# EasyEDA Pro project PCB2.epro

# Board PCB2
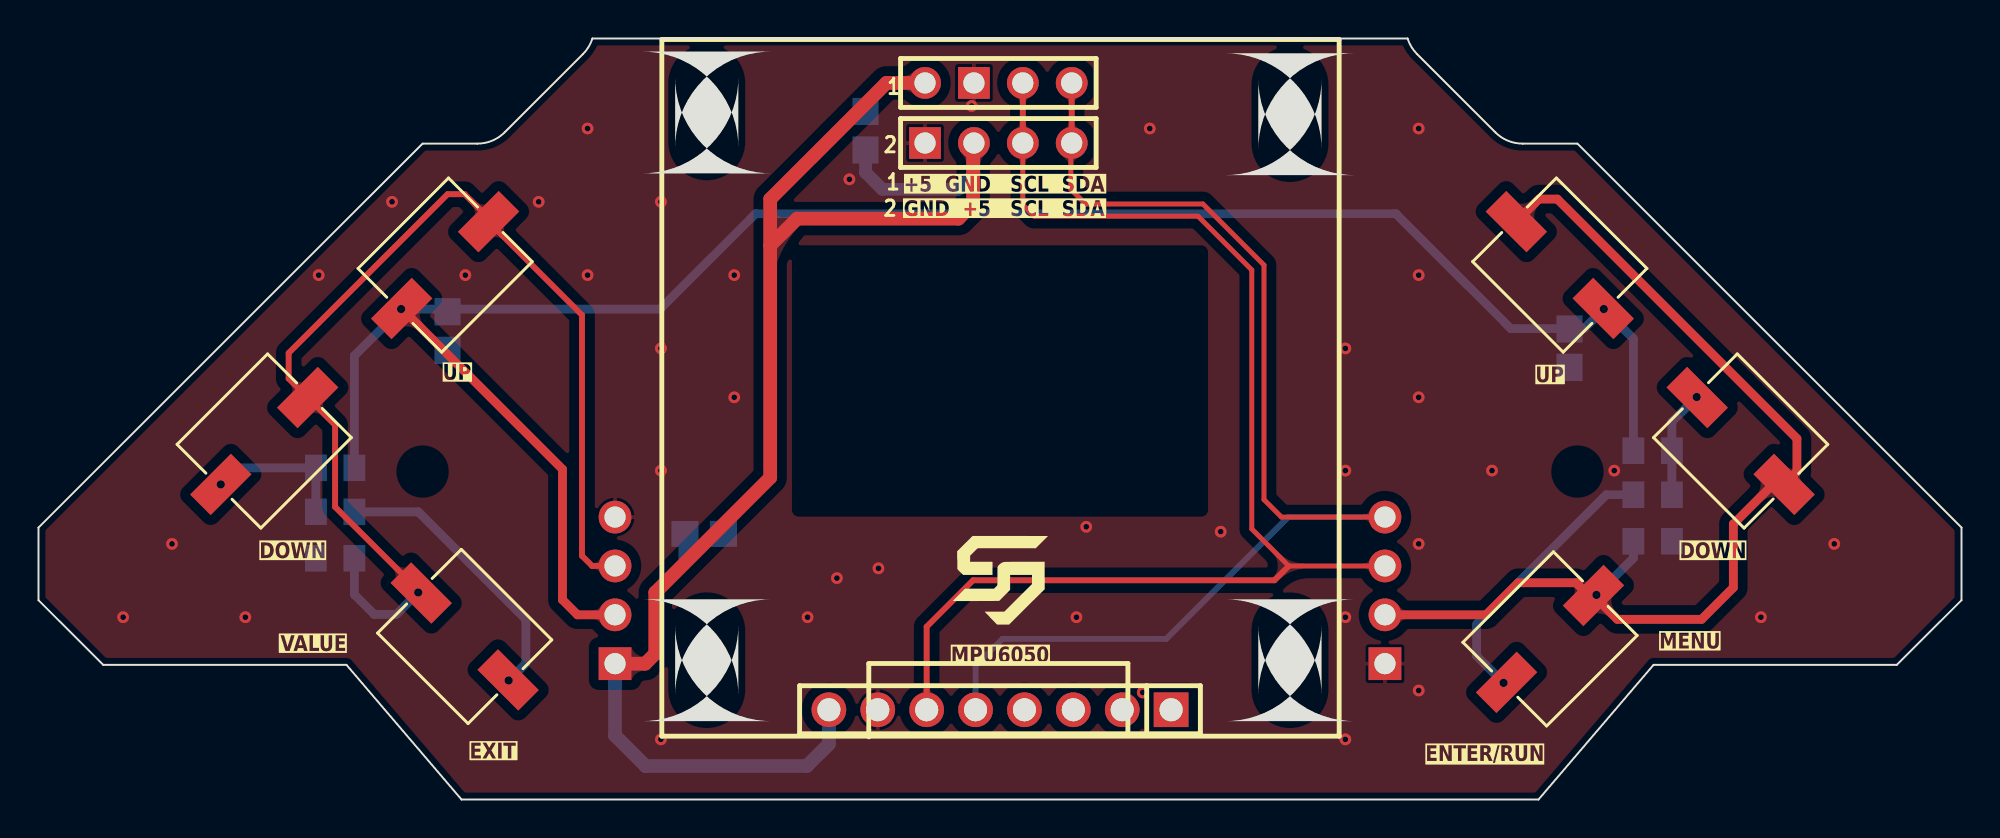
[diagram p0: board, top side]
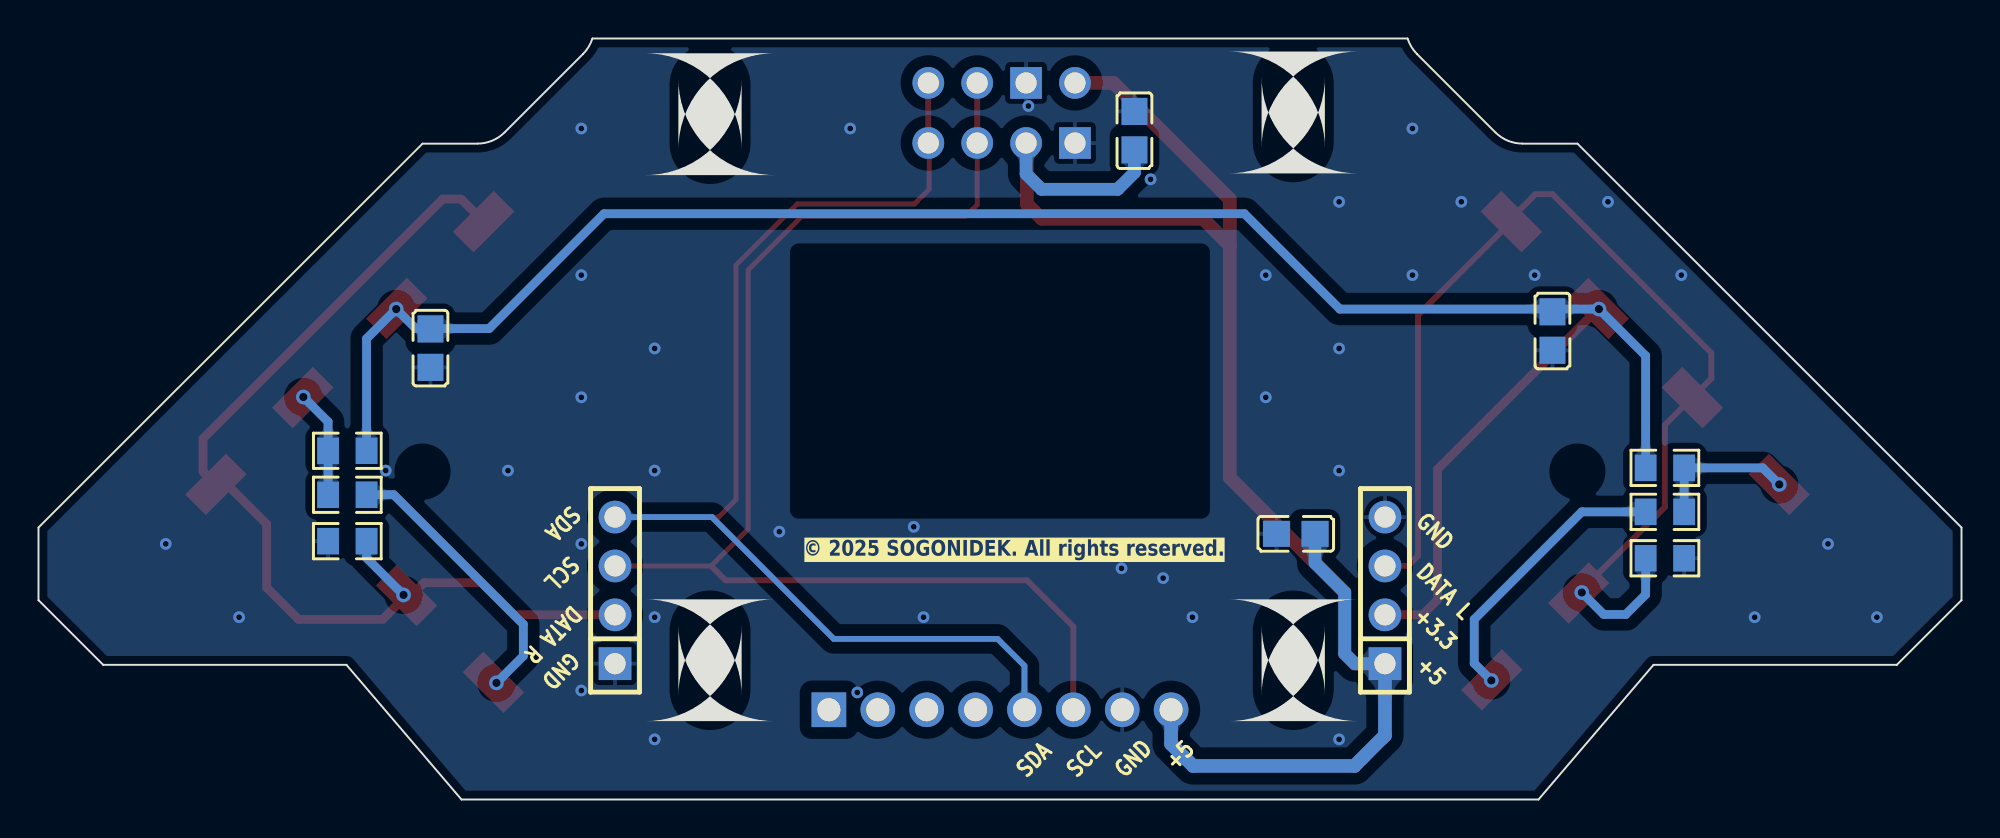
[diagram p1: board, bottom side, seen from below]

Outline 99.91 x 39.56 mm; copper layers: Top Layer, Bottom Layer. Coordinates in mm from the lower left corner of the outline.
Outline path: 0,14.14 19.95,34.09 22.8,34.09 arc(23.57,34.24) 24.22,34.68 28.29,38.75 arc(28.58,39.12) 28.78,39.56 71.13,39.56 arc(71.33,39.12) 71.62,38.75 75.69,34.68 arc(76.34,34.24) 77.1,34.09 79.95,34.09 99.91,14.14 99.91,10.36 96.55,7 83.91,7 77.93,0 21.98,0 16,7 3.36,7 0,10.36 0,14.14
Stack: Top Layer 0.035mm / Dielectric1 1.51mm FR4 er 4.5 / Bottom Layer 0.035mm

## Design rules (mm)
template: Custom Config
spacing copperThickness1oz (default): track to track 0.102, other pairs 0.152 to 0.3
spacing copperThickness2oz: track to track 0.203, other pairs 0.152 to 0.3
track width copperThickness1oz (default): min 0.127, default 0.254, max 2.54
track width copperThickness2oz: min 0.203, default 0.254, max 2.54
differential pair differentialPair (default): width min 0.127, default 0.254, max 2.54; gap min 0.152, default 0.152
via viaSize (default): diameter min 0.5, default 0.61, max 10; hole min 0.3, default 0.305, max 6.299
pour e180 uses copperRegion
pour e249 uses copperRegion

## Placement (name value [footprint] x y rotation side)
C2  100nF  [C0805]  21.25 24.35 270 bottom
C4  100nF  [C0805]  79.55 23.46 270 bottom
C5  100nF  [C0805]  34.59 13.81 0 bottom
C6  100nF  [C0805]  42.97 34.76 90 bottom
H9  -  [HDR-TH_4P-P2.54-V-F]  29.95 10.87 90 bottom
H10  -  [HDR-TH_4P-P2.54-V-F]  69.95 10.87 90 bottom
H11  -  [HDR-TH_8P-P2.54-V-F-1]  49.95 4.67 180 top
R32  10K  [R0805]  15.41 12.54 0 bottom
R33  4K7  [R0805]  15.41 17.24 180 bottom
R34  4k7  [R0805]  15.41 14.95 0 bottom
R35  4K7  [R0805]  83.86 18.13 0 bottom
R36  4K7  [R0805]  83.86 15.84 180 bottom
R37  10K  [R0805]  83.86 13.43 180 bottom
SW2  SPEH110100  [SW-SMD_L6.0-W6.0-LS6.6]  21.12 27.78 45 top
SW3  PUSH BUTTON  [SW-SMD_L6.0-W6.0-LS6.6]  11.73 18.63 45 top
SW4  EXIT  [SW-SMD_L6.0-W6.0-LS6.6]  22.14 8.47 135 top
SW6  PUSH BUTTON  [SW-SMD_L6.0-W6.0-LS6.6]  78.53 8.35 45 top
SW7  PUSH BUTTON  [SW-SMD_L6.0-W6.0-LS6.6]  79.04 27.78 135 top
SW8  PUSH BUTTON  [SW-SMD_L6.0-W6.0-LS6.6]  88.43 18.63 315 top
U1  1.3 OLED2  [OLED-TH12864]  49.87 34.12 0 top
U3  1.3 OLED  [OLED-TH12864#2]  49.87 37.25 0 top

## Footprints (pads in the part's own frame, mm; a bottom-side part is the same pattern mirrored in y, then rotated)
C0805
  rect 1.41x1.35 smd: 1(-1,0) 2(1,0)
HDR-TH_4P-P2.54-V-F
  rect 1.7x1.7 hole 1.1: 1(-3.81,0)
  round 1.7 hole 1.1: 2(-1.27,0) 3(1.27,0) 4(3.81,0)
HDR-TH_8P-P2.54-V-F-1
  rect 1.8x1.8 hole 1.2: 1(-8.89,0)
  round 1.8 hole 1.2: 2(-6.35,0) 3(-3.81,0) 4(-1.27,0) 5(1.27,0) 6(3.81,0) 7(6.35,0) 8(8.89,0)
OLED-TH12864
  rect 1.65x1.65 hole 1.1: 1(-3.81,0)
  round 1.65 hole 1.1: 2(-1.27,0) 3(1.27,0) 4(3.81,0)
OLED-TH12864#2
  round 1.65 hole 1.1: 1(-3.81,0) 3(1.27,0) 4(3.81,0)
  rect 1.65x1.65 hole 1.1: 2(-1.27,0)
R0805
  rect 1.133x1.377 smd: 1(-1,0) 2(1,0)
SW-SMD_L6.0-W6.0-LS6.6
  rect 3x1.512 smd: 1(-3.192,0) 2(3.192,0)

## Nets
+3.3V: C2.1 C4.1 H9.2 R33.1 R35.1 SW2.1 SW7.1
+5V: C5.1 C6.1 H9.1 H11.8 U1.2 U3.1
GND: C2.2 C4.2 C5.2 C6.2 H9.4 H10.1 H11.7 R32.1 R37.1 U1.1 U3.2
BTNL: H9.3 R32.2 SW2.2 SW3.2 SW4.2
BTNR: H10.2 R37.2 SW6.2 SW7.2 SW8.2
SCL: H10.3 H11.6 U1.3 U3.3
SDA: H10.4 H11.5 U1.4 U3.4
$1N1159: R33.2 R34.1 SW3.1
$1N1165: R34.2 SW4.1
$1N1281: R35.2 R36.1 SW8.1
$1N1294: R36.2 SW6.1

Pads without a net: H11 1 2 3 4

## Via types
v1: diameter 0.762, hole 0.432, Top Layer to Bottom Layer, 8 vias
v2: diameter 0.61, hole 0.305, Top Layer to Bottom Layer, 38 vias

## Routing (per net, layer and track width the routed paths; a pad name or vN(x,y) marks a point on that pad's centre or on a via; arc(x,y) is an arc through that point)
+3.3V: length 106.4
  Top Layer w0.457: v1(81.32,25.49) SW7.1 ; H9.2 28,9.6 27.22,10.38 27.22,17.17 SW2.1 v1(18.84,25.49)
  Bottom Layer w0.457: R33.1 16.41,23.06 v1(18.84,25.49) 32.3,25.49 37.25,30.45 70.53,30.45 76.5,24.48 80.31,24.48 v1(81.32,25.49) 82.86,23.95 R35.1
+5V: length 89.6
  Top Layer w0.711: U3.1 44.05,37.25 38.02,31.21 38.02,28.79 ; 38.02,28.79 38.02,16.73 32.05,10.76 32.05,7.59 31.52,7.06 H9.1 ; 38.02,28.79 39.41,30.19 47.8,30.19 48.56,30.95 48.56,34.08 U1.2
  Bottom Layer w0.66: H9.1 31.52,7.06 32.05,7.59 32.05,10.76 33.59,12.3 C5.1 ; U1.2 48.6,32.52 47.8,31.72 43.84,31.72 42.97,32.59 C6.1
  Bottom Layer w0.711: H11.8 41.06,2.89 39.92,1.74 31.54,1.74 29.95,3.33 H9.1
GND:
  vias: v2(4.4,9.48) v2(6.94,13.29) v2(10.75,9.48) v2(14.56,27.26) v2(18.37,31.07) v2(22.18,27.26) v2(25.99,31.07) v2(28.53,34.88) v2(28.53,27.26) v2(32.34,31.07) v2(32.34,23.45) v2(32.34,17.1) v2(32.34,3.13) v2(36.15,27.26) v2(36.15,20.91) v2(39.96,9.48) v2(41.48,11.51) v2(42.13,32.24) v2(43.64,12.02) v2(48.48,36.05) v2(53.93,9.48) v2(54.43,14.18) v2(57.37,5.57) v2(57.74,34.88) v2(61.42,13.92) v2(67.9,23.45) v2(67.9,17.1) v2(67.9,9.48) v2(67.9,3.13) v2(71.71,34.88) v2(71.71,27.26) v2(71.71,20.91) v2(71.71,13.29) v2(71.71,5.67) v2(75.52,17.1) v2(81.87,17.1) v2(89.49,9.48) v2(93.3,13.29)
BTNL: length 57.4
  Top Layer w0.305: 19.85,10.76 15.41,15.21 15.41,19.47 SW3.2 13,21.88 13,23.21 21.25,31.46 22.14,31.46 23.38,30.22 SW2.2 28.24,25.18 28.24,12.67 28.76,12.14 H9.3
  Top Layer w0.457: SW4.2 19.85,10.76 v1(19.73,10.76)
  Bottom Layer w0.457: R32.2 16.41,10.65 17.44,9.62 18.58,9.62 v1(19.73,10.76)
BTNR: length 53.7
  Top Layer w0.457: SW6.2 80.54,10.61 79.87,11.27 76.88,11.27 75.21,9.6 H10.2 ; SW6.2 82.03,9.36 86.4,9.36 88.05,11.02 88.05,14.32 90.11,16.38 SW8.2 91.36,17.04 91.36,18.76 78.91,31.21 77.95,31.21 SW7.2 ; SW6.2 80.91,10.61 v1(80.94,10.63)
  Bottom Layer w0.457: v1(80.94,10.63) 82.86,12.55 R37.2
SCL: length 65.2
  Top Layer w0.254: H10.3 64.96,12.14 63.03,14.06 63.03,27.52 60.24,30.32 51.73,30.32 51.14,30.91 U1.3
  Top Layer w0.305: U1.3 U3.3 ; 64.96,12.14 64.21,11.4 48.56,11.4 46.14,8.98 H11.6
SDA: length 62.8
  Top Layer w0.254: H10.4 64.58,14.68 63.67,15.59 63.67,27.78 60.49,30.95 54.4,30.95 53.64,31.72 53.64,34.08 U1.4
  Top Layer w0.305: U1.4 U3.4
  Bottom Layer w0.305: H11.5 48.68,6.95 50.08,8.35 58.59,8.35 64.92,14.68 H10.4
$1N1159: length 7.6
  Bottom Layer w0.457: v1(9.47,16.38) 10.33,17.24 R33.2 R34.1
$1N1165: length 14.8
  Top Layer w0.457: v1(24.43,6.19) SW4.1
  Bottom Layer w0.457: R34.2 19.73,14.95 25.32,9.36 25.32,7.08 v1(24.43,6.19)
$1N1281: length 5.7
  Top Layer w0.457: v1(86.15,20.92) SW8.1
  Bottom Layer w0.457: R36.1 R35.2 84.86,19.63 v1(86.15,20.92)
$1N1294: length 14.7
  Top Layer w0.457: SW6.1 76.24,6.06 v1(76.12,6.06)
  Bottom Layer w0.457: R36.2 81.45,15.84 74.72,9.11 74.72,7.46 v1(76.12,6.06)

## Copper pours and planes (outline as drawn; the poured copper is in the pictures)
GND on Top Layer: -6.82,42 103.17,42 103.17,-3.59 -6.82,-3.59
GND on Bottom Layer: -5.29,42 102.02,42 102.02,-2.83 -5.29,-2.83

Small or netless copper shapes (teardrops, artwork), in the pictures only: 31 on Top Layer, 34 on Bottom Layer

## Text on the board
Bottom Silkscreen Layer: +5 | GND | SCL | SDA | DATA L | +3.3 | DATA R | © 2025 SOGONIDEK. All rights reserved.
Top Silkscreen Layer: 2 | 1 | DOWN | VALUE | UP | EXIT | +5  GND   SCL  SDA | GND  +5   SCL  SDA | MPU6050 | ENTER/RUN | MENU
